# Altium schematic sheet PowerSupply.SchDoc: Power Supply Main PCB
size A4; Author: A. Kalberer; CompanyName: NTB; Organization: NTB Interstate University of Applied; Address1: Werdenbergstrasse 4; Address3: 9471 Buchs; Address4: Switzerland; Revision: 0.1; SheetNumber: 2; SheetTotal: 2; Organization1: Sciences of Technology Buchs; Size: A4; ShortDescription: Power Supply
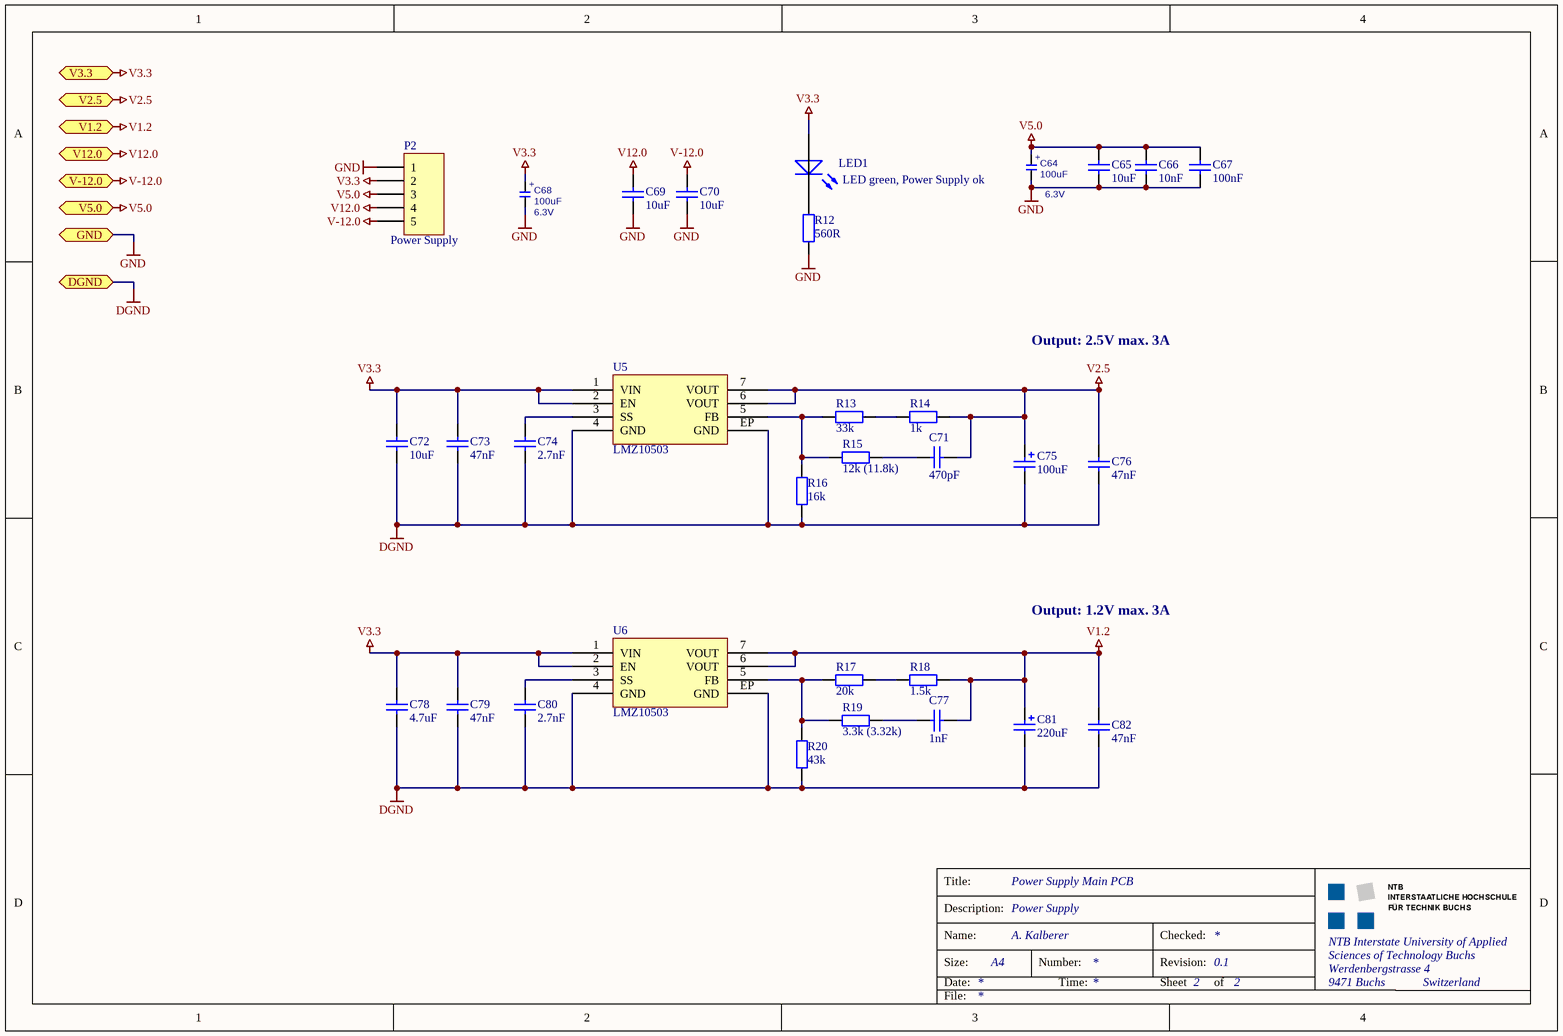
[diagram p0: PowerSupply.SchDoc]

## Parts
C64  Rating: 6.3V  [1206_Pol]  (hidden comment: 100uF)
C65  10uF  [1206]
C66  10nF  [0603_3D]
C67  100nF  [0603_3D]
C68  Rating: 6.3V  [1206_Pol]  (hidden comment: 100uF)
C69  10uF  [1206]
C70  10uF  [1206]
C71  470pF  [0603_3D]
C72  10uF  [1206]
C73  47nF  [0603_3D]
C74  2.7nF  [0603_3D]
C75  100uF  [1812_Pol]
C76  47nF  [0603_3D]
C77  1nF  [0603_3D]
C78  4.7uF  [1206]
C79  47nF  [0603_3D]
C80  2.7nF  [0603_3D]
C81  220uF  [CC-Type-B-3528]
C82  47nF  [0603_3D]
LED1  LED green, Power Supply ok  [0805]
P2  Power Supply  [Header - 1x5 - H]
R12  560R  [0603_3D]
R13  33k  [0603_3D]
R14  1k  [0603_3D]
R15  12k (11.8k)  [0603_3D]
R16  16k  [0603_3D]
R17  20k  [0603_3D]
R18  1.5k  [0603_3D]
R19  3.3k (3.32k)  [0603_3D]
R20  43k  [0603_3D]
U5  LMZ10503  [TZA07A]
U6  LMZ10503  [TZA07A]

## Ports
DGND, GND, V1.2, V2.5, V3.3, V5.0, V12.0, V-12.0

## Nets
DGND: C72.1 C73.1 C74.1 C75.2(Neg) C76.1 C78.1 C79.1 C80.1 C81.2(Neg) C82.1 R16.2 R20.2 U5.4(GND) U5.EP(GND) U6.4(GND) U6.EP(GND) ; port DGND
GND: C64.2 C65.1 C66.1 C67.1 C68.2 C69.1 C70.1 P2.1 R12.1 ; port GND
V1.2: C77.1 C81.1(Pos) C82.2 R18.2 U6.6(VOUT) U6.7(VOUT) ; port V1.2
V2.5: C71.1 C75.1(Pos) C76.2 R14.2 U5.6(VOUT) U5.7(VOUT) ; port V2.5
V3.3: C68.1 C72.2 C73.2 C78.2 C79.2 LED1.2(A) P2.2 U5.1(VIN) U5.2(EN) U6.1(VIN) U6.2(EN) ; port V3.3
V5.0: C64.1 C65.2 C66.2 C67.2 P2.3 ; port V5.0
V12.0: C69.2 P2.4 ; port V12.0
V-12.0: C70.2 P2.5 ; port V-12.0
NetC71_2: C71.2 R15.2
NetC74_2: C74.2 U5.3(SS)
NetC77_2: C77.2 R19.2
NetC80_2: C80.2 U6.3(SS)
NetLED1_1: LED1.1(K) R12.2
NetR13_1: R13.1 R15.1 R16.1 U5.5(FB)
NetR13_2: R13.2 R14.1
NetR17_1: R17.1 R19.1 R20.1 U6.5(FB)
NetR17_2: R17.2 R18.1

## Notes on the sheet
- Output: 2.5V max. 3A
- Output: 1.2V max. 3A
- Title:
- Description:
- Size:
- Date:
- Name:
- Number:
- Time:
- Revision:
- Sheet
- Checked:
- of
- File:
- (in symbol C-TA-100uF-10V-20%-3528) +

## Library data of the parts
C64 C68 = C-TA-100uF-10V-20%-3528: Capacitor TA 100uF 10V 20% 3528; Manufacturer: Generic; Tolerance: 20%; Type: TA; Value: 100uF; Manufacturer Part Number: *
C65 C69 C70 C72 C78 = C: Capacitor; #Manufacturer: Generic Components; #Publisher: Dr. A. Heinzelmann; #Class: Passive; Initial Voltage: 0V; Type: Ceramic; #Published: 2006-10-07; #ClassSub: Capacitor; Voltage Maximum: *
  C65 C69 C70 C72: Value: 10uF
  C78: Value: 4.7uF
C66 C67 C71 C73 C74 C76 C77 C79 C80 C82 = C: Capacitor; #Manufacturer: Generic Components; #Publisher: Dr. A. Heinzelmann; #Class: Passive; Initial Voltage: 0V; #Published: 2006-10-07; #ClassSub: Capacitor; Type: *; Voltage Maximum: *
  C66: Value: 10nF
  C67: Value: 100nF
  C71: Value: 470pF
  C73 C76 C79 C82: Value: 47nF
  C74 C80: Value: 2.7nF
  C77: Value: 1nF
C75 C81 = C_POL: Polarized Capacitor Positive Mark Bar; #Manufacturer: Generic Components; #Publisher: Dr. A. Heinzelmann; #Class: Passive; Initial Voltage: 0V; Type: Tantal; #Published: 2006-10-07; #ClassSub: Capacitor; Voltage Maxium: *
  C75: Value: 100uF
  C81: Value: 220uF
LED1 = LED: Typical RED, GREEN, YELLOW, AMBER GaAs LED; #Manufacturer: Generic Components; #Publisher: Dr. A. Heinzelmann; #Class: Optoelectronic; #Published: 2006-10-31; #ClassSub: LED; Color: *; Type: *
P2 = Header 1x5: Header, 5-Pin; LatestRevisionDate: 17-Jul-2002; LatestRevisionNote: Re-released for DXP Platform.; Publisher: Altium Limited
R12-R20 = R: Resistor; #Manufacturer: Generic Components; #Publisher: Dr. A. Heinzelmann; #Class: Passive; #Published: 2006-10-06; #ClassSub: Resistor; Type: *
  R12: Value: 560R
  R13: Value: 33k
  R14: Value: 1k
  R15: Value: 12k (11.8k)
  R16: Value: 16k
  R17: Value: 20k
  R18: Value: 1.5k
  R19: Value: 3.3k (3.32k)
  R20: Value: 43k
U5 U6 = LMZ10503: Buck Converter